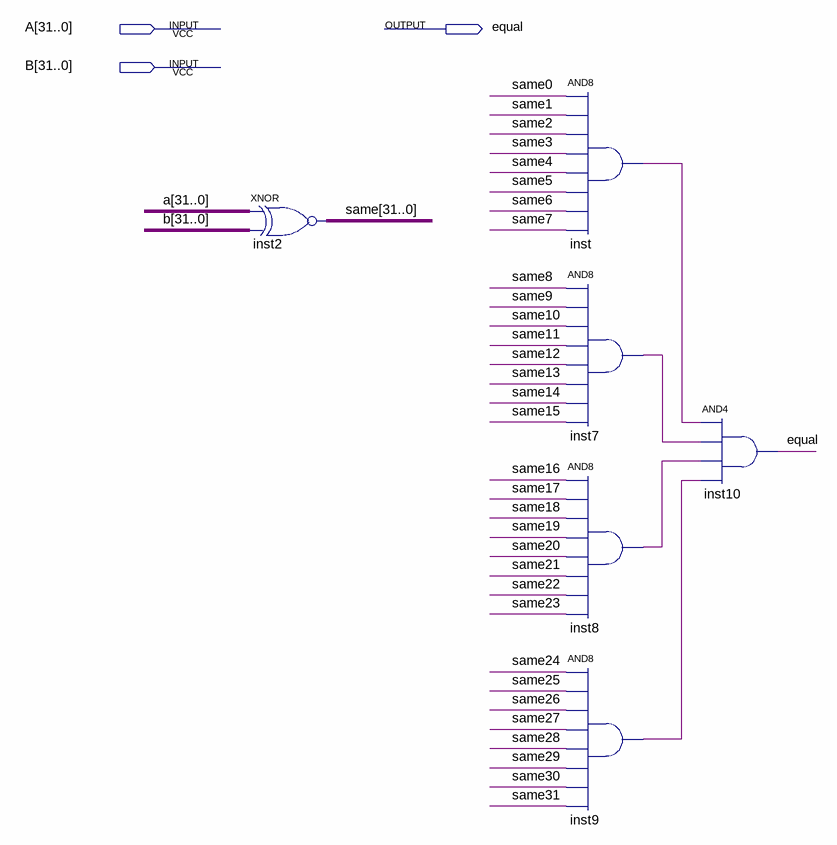
[diagram p0: schematic sheet]
// Quartus schematic Equal32.bdf as structural Verilog: 6 symbols, 3 pins
module Equal32 (
  input  [31:0] A,
  input  [31:0] B,
  output equal
);

  wire inst7_out, inst8_out, inst9_out, inst_out;
  wire [31:0] same;

  assign same = ~(A ^ B);  // XNOR inst2, 32 bits wide
  and inst (inst_out, same[0], same[1], same[2], same[3], same[4], same[5], same[6], same[7]);
  and inst7 (inst7_out, same[8], same[9], same[10], same[11], same[12], same[13], same[14], same[15]);
  and inst8 (inst8_out, same[16], same[17], same[18], same[19], same[20], same[21], same[22], same[23]);
  and inst9 (inst9_out, same[24], same[25], same[26], same[27], same[28], same[29], same[30], same[31]);
  and inst10 (equal, inst_out, inst7_out, inst8_out, inst9_out);
endmodule
